# EAGLE design shield_nano_Completo (EAGLE 7.6.0)
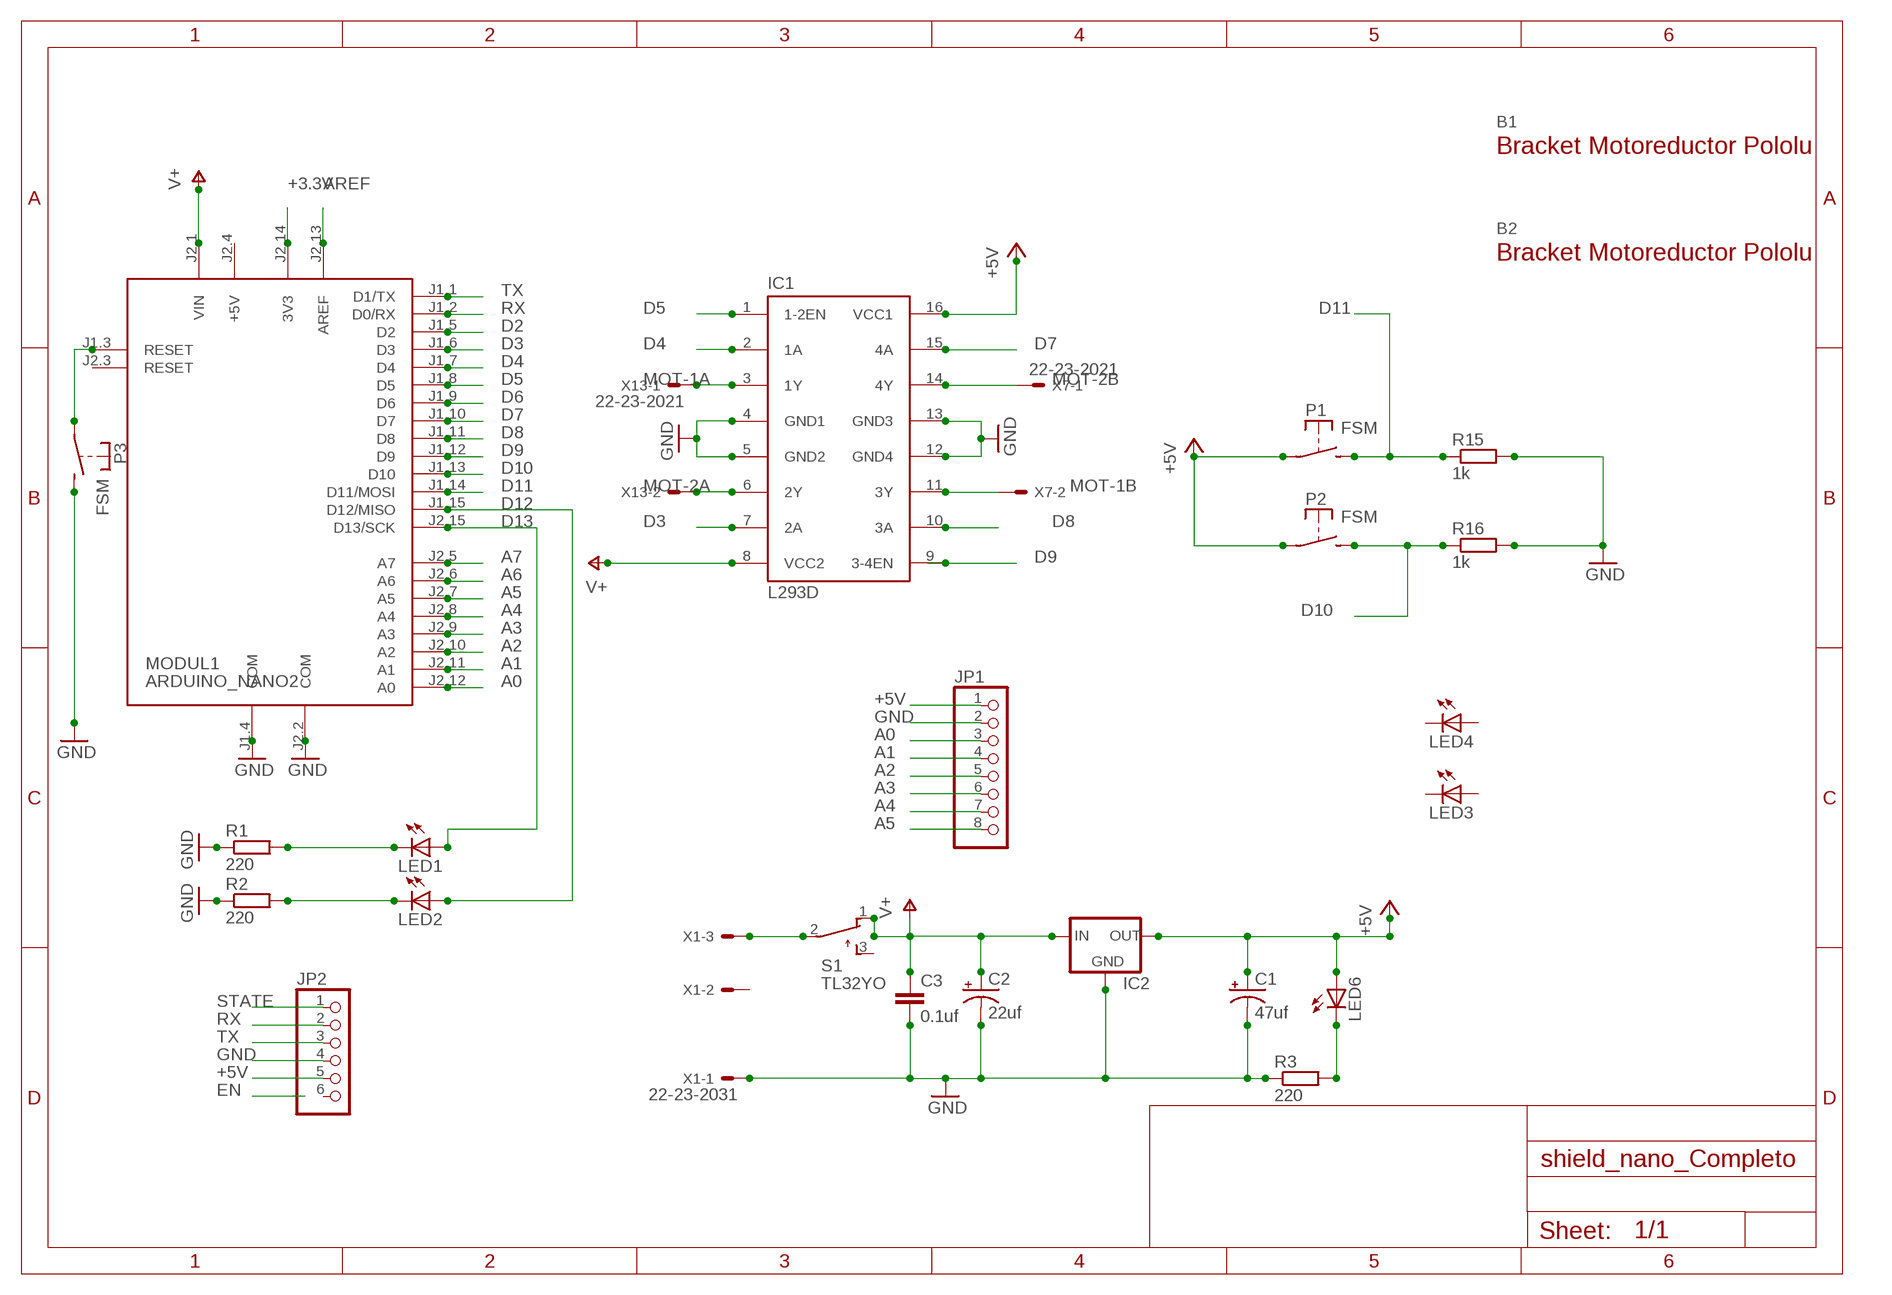
[diagram p0: schematic, sheet 1]

## Parts
B1  BRACKET-MOTOR-REDUCTOR-POLOLU  [BRACKET-MOTORREDUCTOR-POLOLU]
B2  BRACKET-MOTOR-REDUCTOR-POLOLU  [BRACKET-MOTORREDUCTOR-POLOLU]
C1  47uf  CAP_POLPTH1  [CPOL-RADIAL-100UF-25V]
C2  22uf  CAP_POLPTH1  [CPOL-RADIAL-100UF-25V]
C3  0.1uf  C-EU025-030X050  [C025-030X050]
IC1  L293D  [DIL16]
IC2  V_REG_78XX-TO-220  [TO-220-ALT]
JP1  PINHD-1X8  [1X08]
JP2  PINHD-1X6  [1X06]
LED1  LED5MM  [LED5MM]
LED2  LED5MM  [LED5MM]
LED3  LED5MM  [LED5MM]
LED4  LED5MM  [LED5MM]
LED6  LED5MM  [LED5MM]
MODUL1  ARDUINO_NANO2  [ARDUINO_NANO2]
P1  FSM  [FSM]
P2  FSM  [FSM]
P3  FSM  [FSM]
R1  220  R-EU_0204/5  [0204/5]
R2  220  R-EU_0204/5  [0204/5]
R3  220  R-EU_0204/5  [0204/5]
R15  1k  R-EU_0204/5  [0204/5]
R16  1k  R-EU_0204/5  [0204/5]
S1  TL32YO  [TL3XYO]
X1  22-23-2031  [22-23-2031]
X7  22-23-2021  [22-23-2021]
X13  22-23-2021  [22-23-2021]

## Nets
+3.3V: MODUL1.J2.14(3V3)
+5V: C1.1(+) IC1.16(VCC1) IC2.OUT JP1.1 JP2.5 LED6.A P1.P$1(P) P2.P$1(P)
A0: JP1.3 MODUL1.J2.12(A0)
A1: JP1.4 MODUL1.J2.11(A1)
A2: JP1.5 MODUL1.J2.10(A2)
A3: JP1.6 MODUL1.J2.9(A3)
A4: JP1.7 MODUL1.J2.8(A4)
A5: JP1.8 MODUL1.J2.7(A5)
A6: MODUL1.J2.6(A6)
A7: MODUL1.J2.5(A7)
AREF: MODUL1.J2.13(AREF)
D2: MODUL1.J1.5(D2)
D3: IC1.7(2A) MODUL1.J1.6(D3)
D4: IC1.2(1A) MODUL1.J1.7(D4)
D5: IC1.1(1-2EN) MODUL1.J1.8(D5)
D6: MODUL1.J1.9(D6)
D7: IC1.15(4A) MODUL1.J1.10(D7)
D8: IC1.10(3A) MODUL1.J1.11(D8)
D9: IC1.9(3-4EN) MODUL1.J1.12(D9)
D10: MODUL1.J1.13(D10) P2.P$2(S) R16.1
D11: MODUL1.J1.14(D11/MOSI) P1.P$2(S) R15.1
D12: LED2.A MODUL1.J1.15(D12/MISO)
D13: LED1.A MODUL1.J2.15(D13/SCK)
GND: C1.2(-) C2.2(-) C3.2 IC1.4(GND1) IC1.5(GND2) IC1.12(GND4) IC1.13(GND3) IC2.GND JP1.2 JP2.4 MODUL1.J1.4(COM) MODUL1.J2.2(COM) P3.P$2(S) R1.1 R2.1 R3.1 R15.2 R16.2 X1.1
MOT-1A: IC1.3(1Y) X13.1
MOT-1B: IC1.11(3Y) X7.2
MOT-2A: IC1.6(2Y) X13.2
MOT-2B: IC1.14(4Y) X7.1
N$1: S1.2(P) X1.3
N$2: LED1.K(C) R1.2
N$3: LED2.K(C) R2.2
N$8: LED6.K(C) R3.2
N$28: MODUL1.J1.3(RESET) P3.P$1(P)
RX: JP2.2 MODUL1.J1.2(D0/RX)
STATE: JP2.1
TX: JP2.3 MODUL1.J1.1(D1/TX)
V+: C2.1(+) C3.1 IC1.8(VCC2) IC2.IN MODUL1.J2.1(VIN) S1.1(O)
Unconnected: JP2.6 LED3.A LED3.K(C) LED4.A LED4.K(C) MODUL1.J2.3(RESET) S1.3(S) X1.2

## Power pins joined to a net without a drawn wire
+5V: MODUL1.J2.4(+5V)

## Library data of the parts
B1 B2 = Crofi UNAM 13-7-12 (2):BRACKET-MOTOR-REDUCTOR-POLOLU
C1 C2 = SparkFun:CAP_POL: Capacitor Polarized These are standard SMD and PTH capacitors. Normally 10uF, 47uF, and 100uF in electrolytic and tantalum varieties. Always verify the external diameter of the through hole cap, it varies with capacity, voltage, and manufacturer. The EIA devices should be standard.
C3 = rcl:C-EU: CAPACITOR, European symbol
IC1 = st-microelectronics:L293D: PUSH-PULL 4 CHANNEL DRIVER; MPN: L293D; OC_FARNELL: 9589619; OC_NEWARK: 56P8249
IC2 = SparkFun:V_REG_78XX: Voltage Regulator Standard 7805 5V regulator. IGO (Input Ground Output). Spark Fun Electronics SKU : COM-00107
JP1 = pinhead:PINHD-1X8: PIN HEADER
JP2 = pinhead:PINHD-1X6: PIN HEADER
LED1-LED4 LED6 = led:LED: LED OSRAM: - CHIPLED LG R971, LG N971, LY N971, LG Q971, LY Q971, LO R971, LY R971 LH N974, LH R974 LS Q976, LO Q976, LY Q976 LO Q996 - Hyper CHIPLED LW Q18S LB Q993, LB Q99A, LB R99A - SideLED LS A670, LO A670, LY A670, LG A670, LP A670 LB A673, LV A673, LT A673, LW A673 LH A674 LY A675 LS A676, LA A676, LO A676, LY A676, LW A676 LS A679, LY A679, LG A679 - Hyper Micro SIDELED® LS Y876, LA Y876, LO Y876, LY Y876 LT Y87S - SmartLED LW L88C, LW L88S LB L89C, LB L89S, LG L890 LS L89K, LO L89K, LY L89K LS L896, LA L896, LO L896, LY L896 - TOPLED LS T670, LO T670, LY T670, LG T670, LP T670 LSG T670, LSP T670, LSY T670, LOP T670, LYG T670 LG T671, LOG T671, LSG T671 LB T673, LV T673, LT T673, LW T673 LH T674 LS T676, LA T676, LO T676, LY T676, LB T676, LH T676, LSB T676, LW T676 LB T67C, LV T67C, LT T67C, LS T67K, LO T67K, LY T67K, LW E67C LS E67B, LA E67B, LO E67B, LY E67B, LB E67C, LV E67C, LT E67C LW T67C LS T679, LY T679, LG T679 LS T770, LO T770, LY T770, LG T770, LP T770 LB T773, LV T773, LT T773, LW T773 LH T774 LS E675, LA E675, LY E675, LS T675 LS T776, LA T776, LO T776, LY T776, LB T776 LHGB T686 LT T68C, LB T68C - Hyper Mini TOPLED® LB M676 - Mini TOPLED Santana® LG M470 LS M47K, LO M47K, LY M47K Source: http://www.osram.convergy.de LUXEON: - LUMILED® LXK2-PW12-R00, LXK2-PW12-S00, LXK2-PW14-U00, LXK2-PW14-V00 LXK2-PM12-R00, LXK2-PM12-S00, LXK2-PM14-U00 LXK2-PE12-Q00, LXK2-PE12-R00, LXK2-PE12-S00, LXK2-PE14-T00, LXK2-PE14-U00 LXK2-PB12-K00, LXK2-PB12-L00, LXK2-PB12-M00, LXK2-PB14-N00, LXK2-PB14-P00, LXK2-PB14-Q00 LXK2-PR12-L00, LXK2-PR12-M00, LXK2-PR14-Q00, LXK2-PR14-R00 LXK2-PD12-Q00, LXK2-PD12-R00, LXK2-PD12-S00 LXK2-PH12-R00, LXK2-PH12-S00 LXK2-PL12-P00, LXK2-PL12-Q00, LXK2-PL12-R00 Source: www.luxeon.com KINGBRIGHT: KA-3528ASYC Source: www.kingbright.com
MODUL1 = arduino:ARDUINO_NANO2: Arduino Nano2 Auto generated by modulcreator.ulp \;; ANZAHL: 2; MODUL: TRUE; STECKX0: -76200; STECKX1: 76200; STECKY0: 177800; STECKY1: 177800
P1-P3 = switch-misc (2):FSM: TYCO SWITCH
R1-R3 R15 R16 = rcl:R-EU_: RESISTOR, European symbol
S1 = switch:TL32YO: TINY SWITCH ON - MOM Source: http://www2.produktinfo.conrad.com/datenblaetter/700000-724999/705152-da-01-de-Subminiaturschalter_TL_36YO.pdf
X1 = con-molex:22-23-2031: .100" (2.54mm) Center Header - 3 Pin; MF: MOLEX; MPN: 22-23-2031; OC_FARNELL: 1462950; OC_NEWARK: 30C0862
X7 X13 = con-molex:22-23-2021: .100" (2.54mm) Center Header - 2 Pin; MF: MOLEX; MPN: 22-23-2021; OC_FARNELL: 1462926; OC_NEWARK: 25C3832

## Board
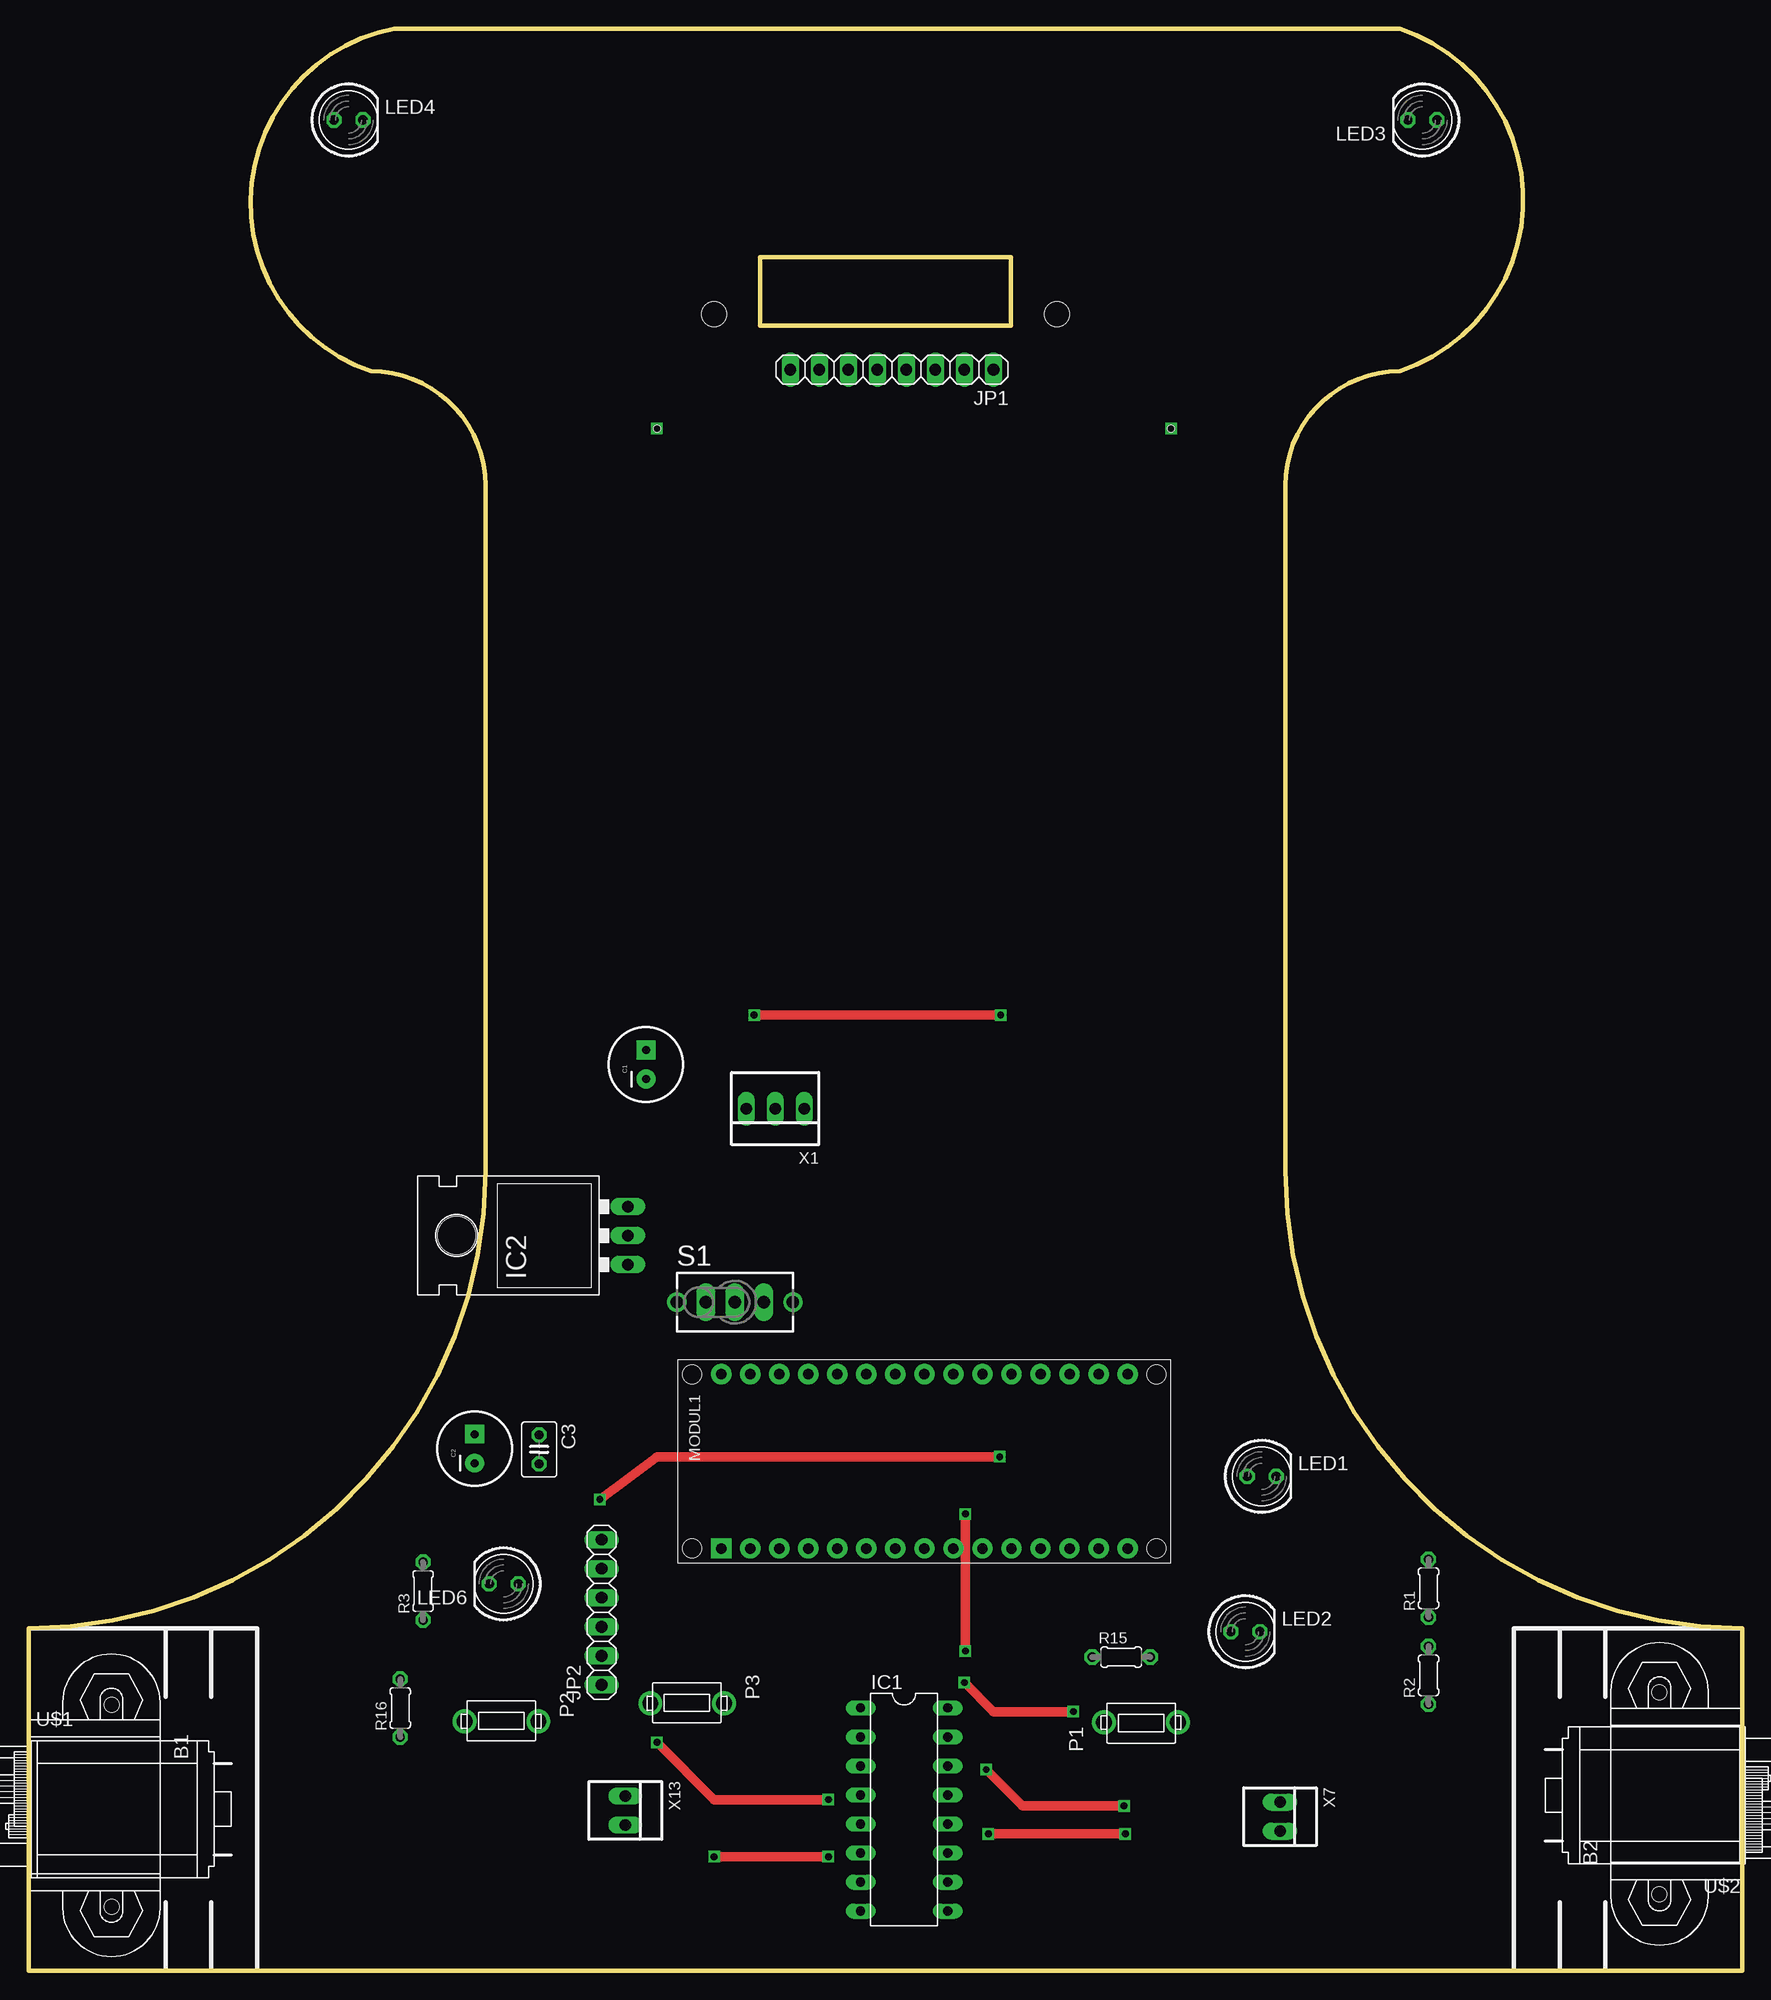
[diagram p1: board, top side]
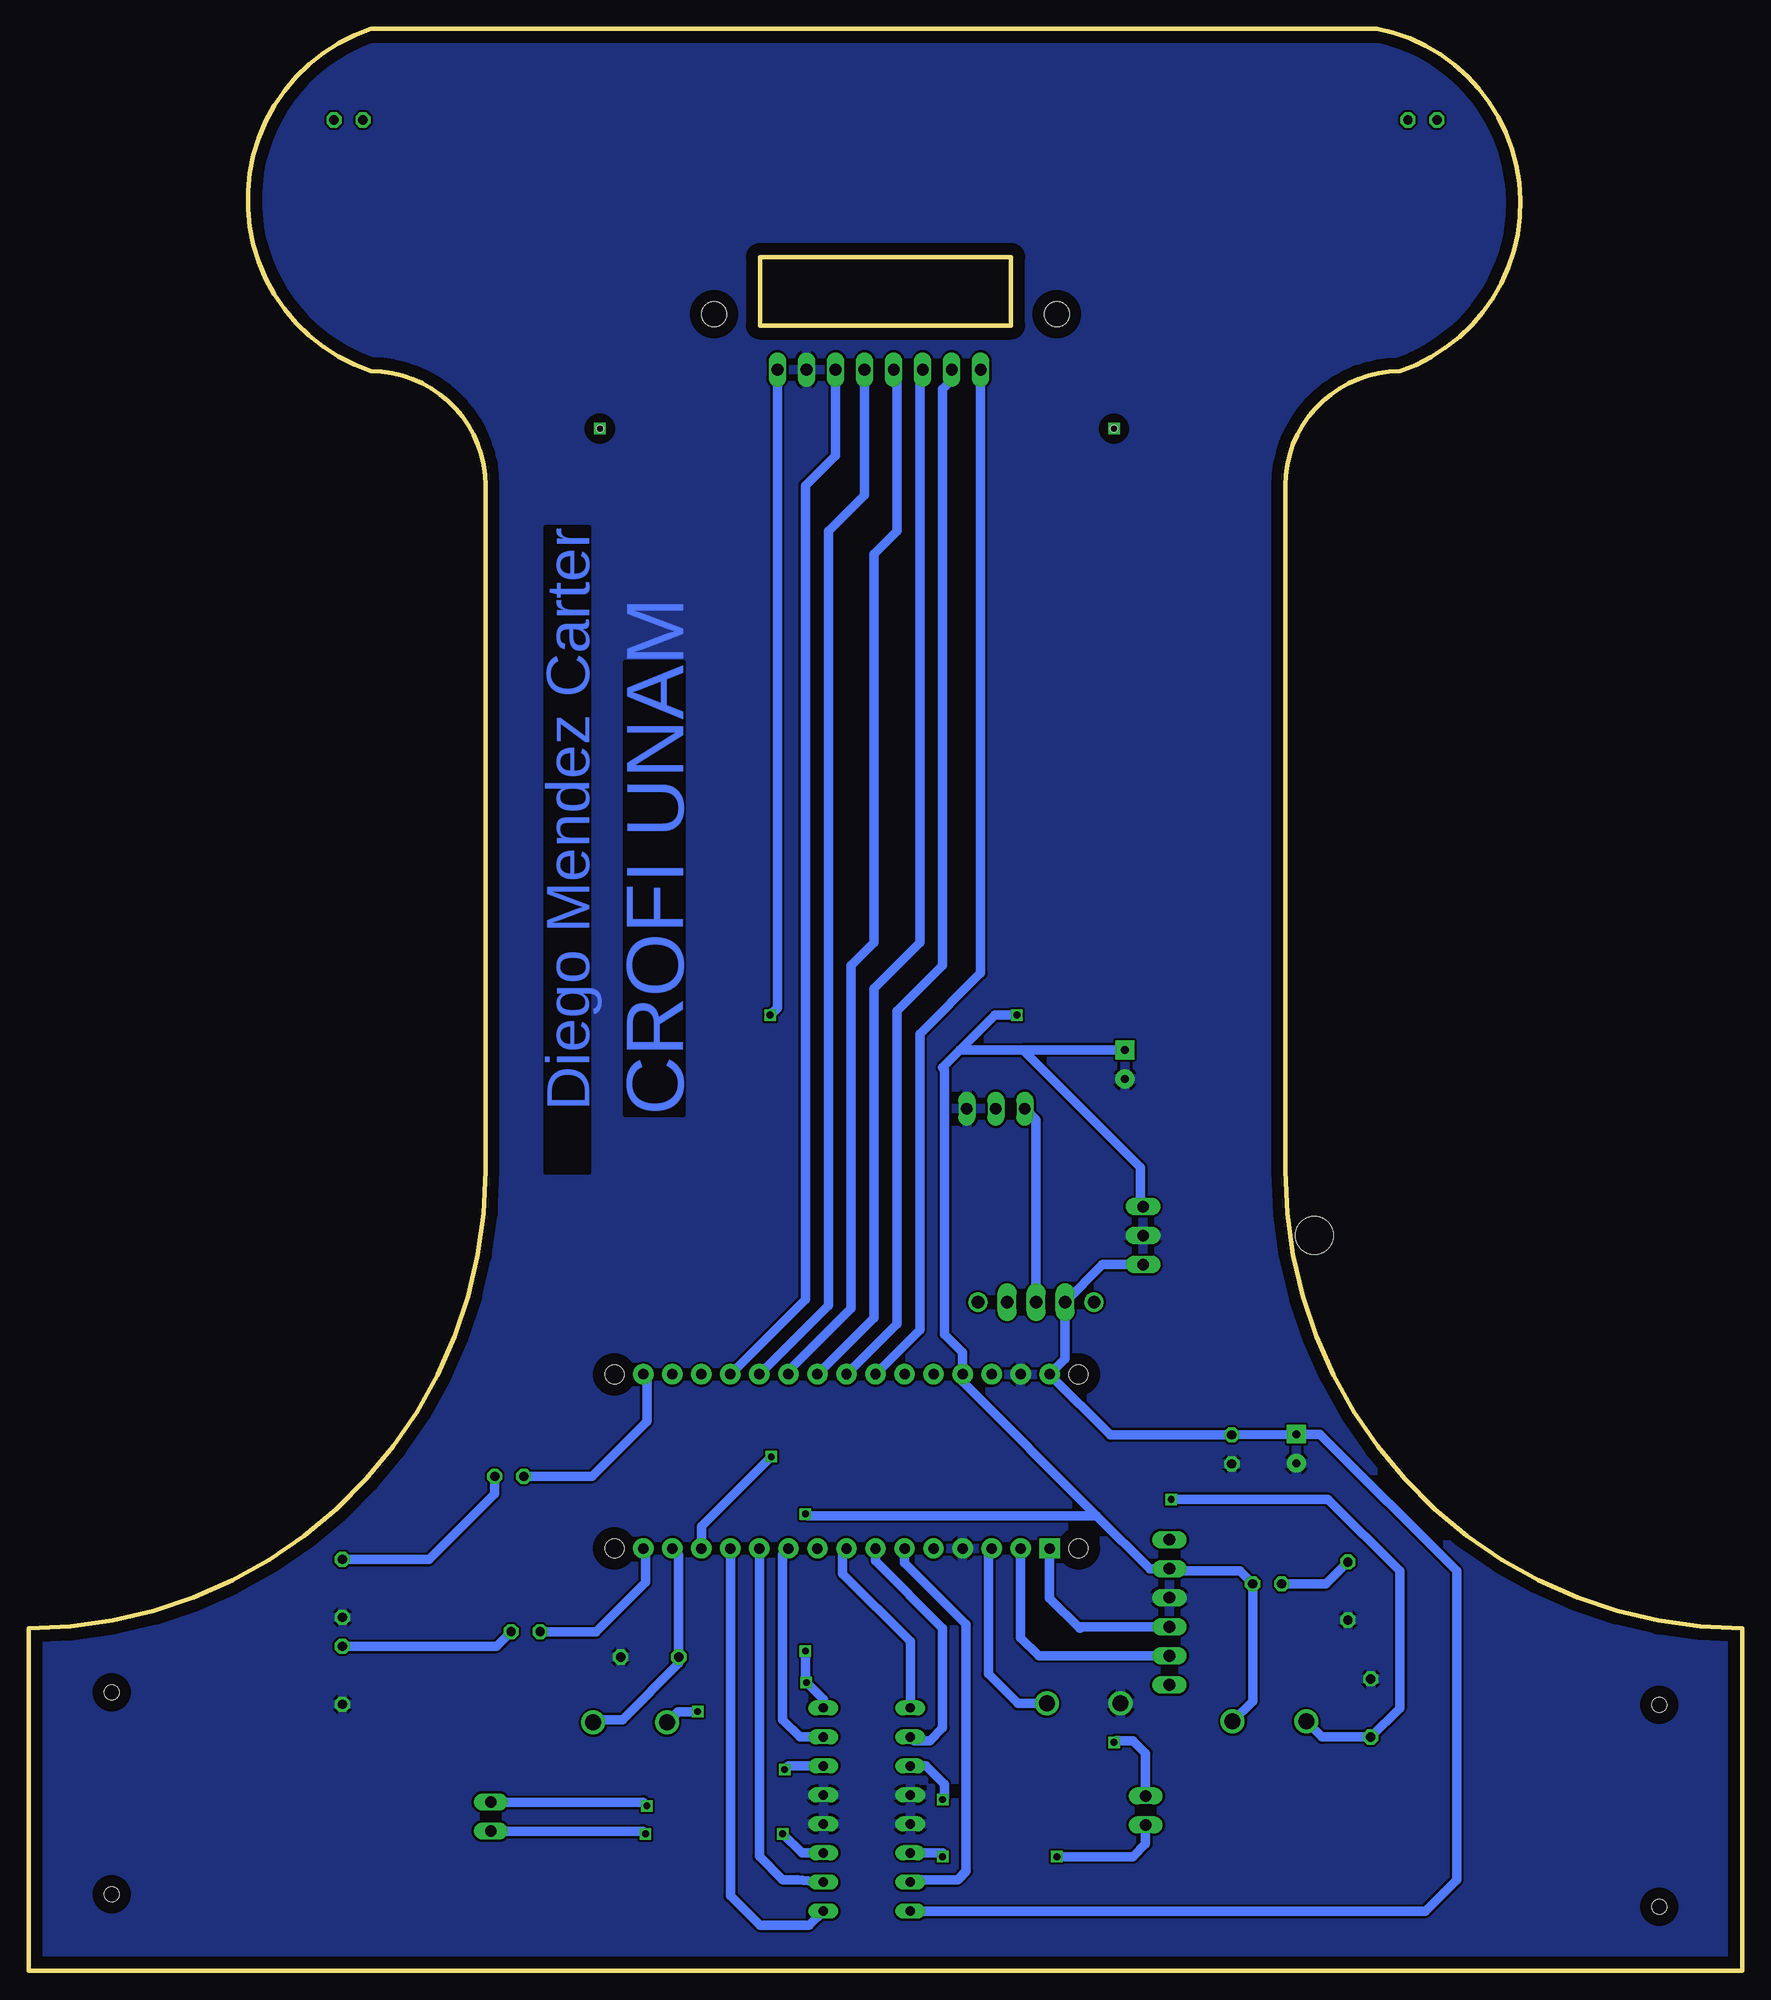
[diagram p2: board, bottom side, seen from below]

Size 150 x 170 mm. Coordinates in mm from the lower left corner, seen from the top.
Outline: 0,0 150,0 150,30 arc-90 110,70 110,130 arc-90 120,140 arc143 120,170 32,170 arc150 30,140 arc-90 40,130 40,70 arc-90 0,30 0,0
Outline: 64,150 86,150 86,144 64,144 64,150
Copper layers (1*16): Top 0.035mm / dielectric 1.5mm / Bottom 0.035mm
Design rules "default": minimum track width 10mil, minimum drill 24mil, track to track 8mil, track to pad 8mil, pad to pad 8mil, via to via 8mil, smd to smd 8mil, copper to edge 40mil, drill to drill 8mil, minimum pad ring 10mil, minimum via ring 8mil, stop-mask expansion 4mil, vias tented up to drill 0mil, thermal gap 10mil
Holes 0.6 mm at 55,135 100,135
Holes 2.2 mm at 60,145 90,145

### Footprints (pad centres in the part's own frame; a part is rotated, then mirrored left to right if it is on the bottom)
BRACKET-MOTORREDUCTOR-POLOLU = hole 1.3: -1.3,7.29; 16.38,7.29
CPOL-RADIAL-100UF-25V = drill 0.7 pad 1.651 square: 1 1.27,0 | drill 0.7 pad 1.651: 2 -1.27,0
C025-030X050 = drill 0.813 octagon: 1 -1.27,0; 2 1.27,0
DIL16 = drill 0.813 long: 1 -8.89,-3.81; 2 -6.35,-3.81; 3 -3.81,-3.81; 4 -1.27,-3.81; 5 1.27,-3.81; 6 3.81,-3.81; 7 6.35,-3.81; 8 8.89,-3.81; 9 8.89,3.81; 10 6.35,3.81; 11 3.81,3.81; 12 1.27,3.81; 13 -1.27,3.81; 14 -3.81,3.81; 15 -6.35,3.81; 16 -8.89,3.81
TO-220-ALT = drill 1.016 long: GND 0,-3.81; IN -2.54,-3.81; OUT 2.54,-3.81 | hole 3.302: 0,11.176
1X08 = drill 1.016 long: 1 -8.89,0; 2 -6.35,0; 3 -3.81,0; 4 -1.27,0; 5 1.27,0; 6 3.81,0; 7 6.35,0; 8 8.89,0
1X06 = drill 1.016 long: 1 -6.35,0; 2 -3.81,0; 3 -1.27,0; 4 1.27,0; 5 3.81,0; 6 6.35,0
LED5MM = drill 0.813 octagon: A -1.27,0; K 1.27,0
ARDUINO_NANO2 = drill 0.914 pad 1.778 square: J1.1 -7.62,17.78 | drill 0.914 pad 1.778: J1.2 -7.62,15.24; J1.3 -7.62,12.7; J1.4 -7.62,10.16; J1.5 -7.62,7.62; J1.6 -7.62,5.08; J1.7 -7.62,2.54; J1.8 -7.62,0; J1.9 -7.62,-2.54; J1.10 -7.62,-5.08; J1.11 -7.62,-7.62; J1.12 -7.62,-10.16; J1.13 -7.62,-12.7; J1.14 -7.62,-15.24; J1.15 -7.62,-17.78; J2.1 7.62,17.78; J2.2 7.62,15.24; J2.3 7.62,12.7; J2.4 7.62,10.16; J2.5 7.62,7.62; J2.6 7.62,5.08; J2.7 7.62,2.54; J2.8 7.62,0; J2.9 7.62,-2.54; J2.10 7.62,-5.08; J2.11 7.62,-7.62; J2.12 7.62,-10.16; J2.13 7.62,-12.7; J2.14 7.62,-15.24; J2.15 7.62,-17.78 | hole 1.651: -7.62,-20.32; 7.62,-20.32; 7.62,20.32; -7.62,20.32
FSM = drill 1.397: P$1 0,3.25; P$2 0,-3.2
0204/5 = drill 0.813 octagon: 1 -2.54,0; 2 2.54,0
TL3XYO = drill 1.1 pad 1.422 long: 1 -2.54,0; 2 0,0; 3 2.54,0 | drill 1.1 pad 1.676: M1 -5.08,0; M2 5.08,0
22-23-2031 = drill 1 long: 1 -2.54,0; 2 0,0; 3 2.54,0
22-23-2021 = drill 1 long: 1 -1.27,0; 2 1.27,0

### Placement (x,y rotation side)
B1  0,22 270 top
B2  150,8 90 top
C1  54.04,79.33 90 top
C2  39.04,45.71 90 top
C3  44.69,45.64 270 top
IC1  76.63,14.13 270 top
IC2  48.65,64.36 90 top
JP1  75.56,140.15 180 top
JP2  50.15,31.39 90 top
LED1  107.93,43.29 0 top
LED2  106.5,29.69 0 top
LED3  122,162 180 top
LED4  28,162 0 top
LED6  41.59,33.88 180 top
MODUL1  78.41,44.6 90 top
P1  97.38,21.74 90 top
P2  41.37,21.84 270 top
P3  57.62,23.42 270 top
R1  122.53,33.49 90 top
R2  122.53,25.87 90 top
R3  34.53,33.25 90 top
R15  95.63,27.47 0 top
R16  32.53,23.01 90 top
S1  61.82,58.53 0 top
U$1  [MOTOR-REDUCTOR-POLOLU]  -8.26,20.16 270 top  (outside the outline)
U$2  [MOTOR-REDUCTOR-POLOLU]  158.75,9.37 90 top  (outside the outline)
X1  65.34,75.47 180 top
X7  109.53,13.5 270 top
X13  52.23,14.05 270 top

### Tracks (layer width: path | path; a pad name or v marks a point on that pad's centre or on a via)
+5V  (via drill 0.6)
  Top 0.813: v82,40 v82,28 | v63.5,83.66 v85.09,83.66 | v91.44,22.7 84.45,22.7 v81.92,25.24
  Bottom 0.813: 68.47,80.6 70,79.06 69.85,78.92 69.85,55.72 68.25,54.12 MODUL1.J2.4 68.25,51.58 56.52,39.84 | 68.47,80.6 62.98,80.6 | 62.98,80.6 52.7,70.33 52.7,67.15 IC2.OUT | C1.1 62.98,80.6 | P2.P$1 42.86,23.6 LED6.A 43.98,35 50.15,35 JP2.5 51.87,35.2 56.52,39.84 | 56.52,39.84 81.84,39.84 v82,40 | v85.09,83.66 84.45,84.3 JP1.1 | 68.47,80.6 65.41,83.66 v63.5,83.66 | P1.P$1 93.17,22.7 v91.44,22.7 | v82,28 82,25.32 v81.92,25.24 80.44,23.77 IC1.16
A0
  Bottom 0.813: MODUL1.J2.12 82,58.79 82,130 79.37,132.63 JP1.3
A1
  Bottom 0.813: MODUL1.J2.11 80,58.25 80,126 76.83,129.17 JP1.4
A2
  Bottom 0.813: MODUL1.J2.10 83.49,52.51 78,58 78,88 76,90 76,124 74,126 74,139.86 JP1.5
A3
  Bottom 0.813: MODUL1.J2.9 76,57.17 76,86 72,90 72,139.9 JP1.6
A4
  Bottom 0.813: MODUL1.J2.8 74,56.63 74,84 70,88 70,138.42 69.21,139.21 JP1.7
A5
  Bottom 0.813: MODUL1.J2.7 72,56.09 72,82 66.67,87.33 JP1.8
D3
  Bottom 0.813: IC1.7 72.6,8 68.67,8 67.94,8.73 67.94,30.32 73.33,35.7 MODUL1.J1.6
D4
  Bottom 0.813: MODUL1.J1.7 75.87,35.87 70,30 70,21.28 71.12,20.16 72.5,20.16 IC1.2
D5
  Bottom 0.813: IC1.1 72.82,28.84 78.74,34.77 78.74,36.65 MODUL1.J1.8
D7
  Bottom 0.813: 80,20.48 IC1.15 82.48,20.48 84,22 84,36.47 MODUL1.J1.10
D8
  Bottom 0.813: MODUL1.J1.11 86.03,10.03 84,8 82.66,8 IC1.10
D9
  Bottom 0.813: MODUL1.J1.12 88.57,6.57 86,4 81.68,4 IC1.9
D10  (via drill 0.6)
  Top 0.813: v50,41.27 55,45 v85,45
  Bottom 0.813: MODUL1.J1.13 91.11,38.89 v85,45 | P2.P$2 36.8,20.47 R16.1 30,23 30,35 36.27,41.27 v50,41.27
D11
  Bottom 0.813: P1.P$2 100.32,22 98,22 93.09,26.91 R15.1 93.09,36.42 MODUL1.J1.14
D12
  Bottom 0.813: LED2.A 100.31,29.69 96,34 96,36.79 MODUL1.J1.15
D13
  Bottom 0.813: LED1.A 100.69,43.29 95.89,48.1 95.89,51.91 MODUL1.J2.15
GND
  pour Bottom: 0,30 0,0 150,0 150,30 arc-90 110,70 110,130 arc-90 120,140 arc90 130,150 130,160 arc90 120,170 30,170 arc90 20,160 20,150 arc90 30,140 arc-90 40,130 38.73,63.65 arc-90
MOT-1A  (via drill 0.6)
  Top 0.813: v55,20 60,15 v70,15
  Bottom 0.813: IC1.3 71.44,17.94 69.85,16.35 69.85,15.15 v70,15 | X13.1 52.23,19.05 53.34,20.16 54.84,20.16 v55,20
MOT-1B  (via drill 0.6)
  Top 0.813: v84,12 v96,12
  Bottom 0.813: IC1.11 82.32,10.32 v84,12 | X7.2 96.23,12.23 v96,12
MOT-2A  (via drill 0.6)
  Top 0.813: v70,10 v60,10
  Bottom 0.813: 70,10.32 v70,10 70.32,10.32 IC1.6 | X13.2 52.23,11.11 53.34,10 v60,10
MOT-2B  (via drill 0.6)
  Top 0.813: v95.89,14.45 87,14.45 v83.82,17.62
  Bottom 0.813: X7.1 96.21,14.77 v95.89,14.45 | v83.82,17.62 83.5,17.94 IC1.14
N$1
  Bottom 0.813: S1.2 61.82,74.49 X1.3
N$2
  Bottom 0.813: R1.2 114.94,36.03 109.22,41.75 109.22,43.27 LED1.K
N$3
  Bottom 0.813: R2.2 109.05,28.41 LED2.K
N$6  (via drill 0.6)
  other vias: 55,135
N$7  (via drill 0.6)
  other vias: 100,135
N$8
  Bottom 0.813: LED6.K 36.44,33.88 R3.2
N$28
  Bottom 0.813: MODUL1.J1.3 66,36.69 66,26 63.42,23.42 P3.P$1
RX
  Bottom 0.813: JP2.2 61.58,27.58 63.17,29.17 MODUL1.J1.2
TX
  Bottom 0.813: JP2.3 57.88,30.12 58,30 60.63,32.63 MODUL1.J1.1
V+
  Bottom 0.813: IC1.8 27.76,5.24 25,8 25,35 36.98,46.98 C2.1 C3.1 55.32,46.91 MODUL1.J2.1 59.28,53.57 S1.1 55.99,61.82 IC2.IN

### Text on the board
Bottom: Diego Mendez Carter | CROFI UNAM